# Altium schematic sheet con-right-bot.SchDoc: CS - Right Bottom
size Letter; CheckedBy: J. Brinton; CompanyName: Signal Laboratories, Inc.; DrawnBy: J. Brinton; Engineer: J. Brinton; Address1: 3479 Edison Way; Address2: Menlo Park CA 94025; Address3: +1 (877) 778-8435; Address4: siglabs.com; Revision: 3; SheetNumber: 36; SheetTotal: 47
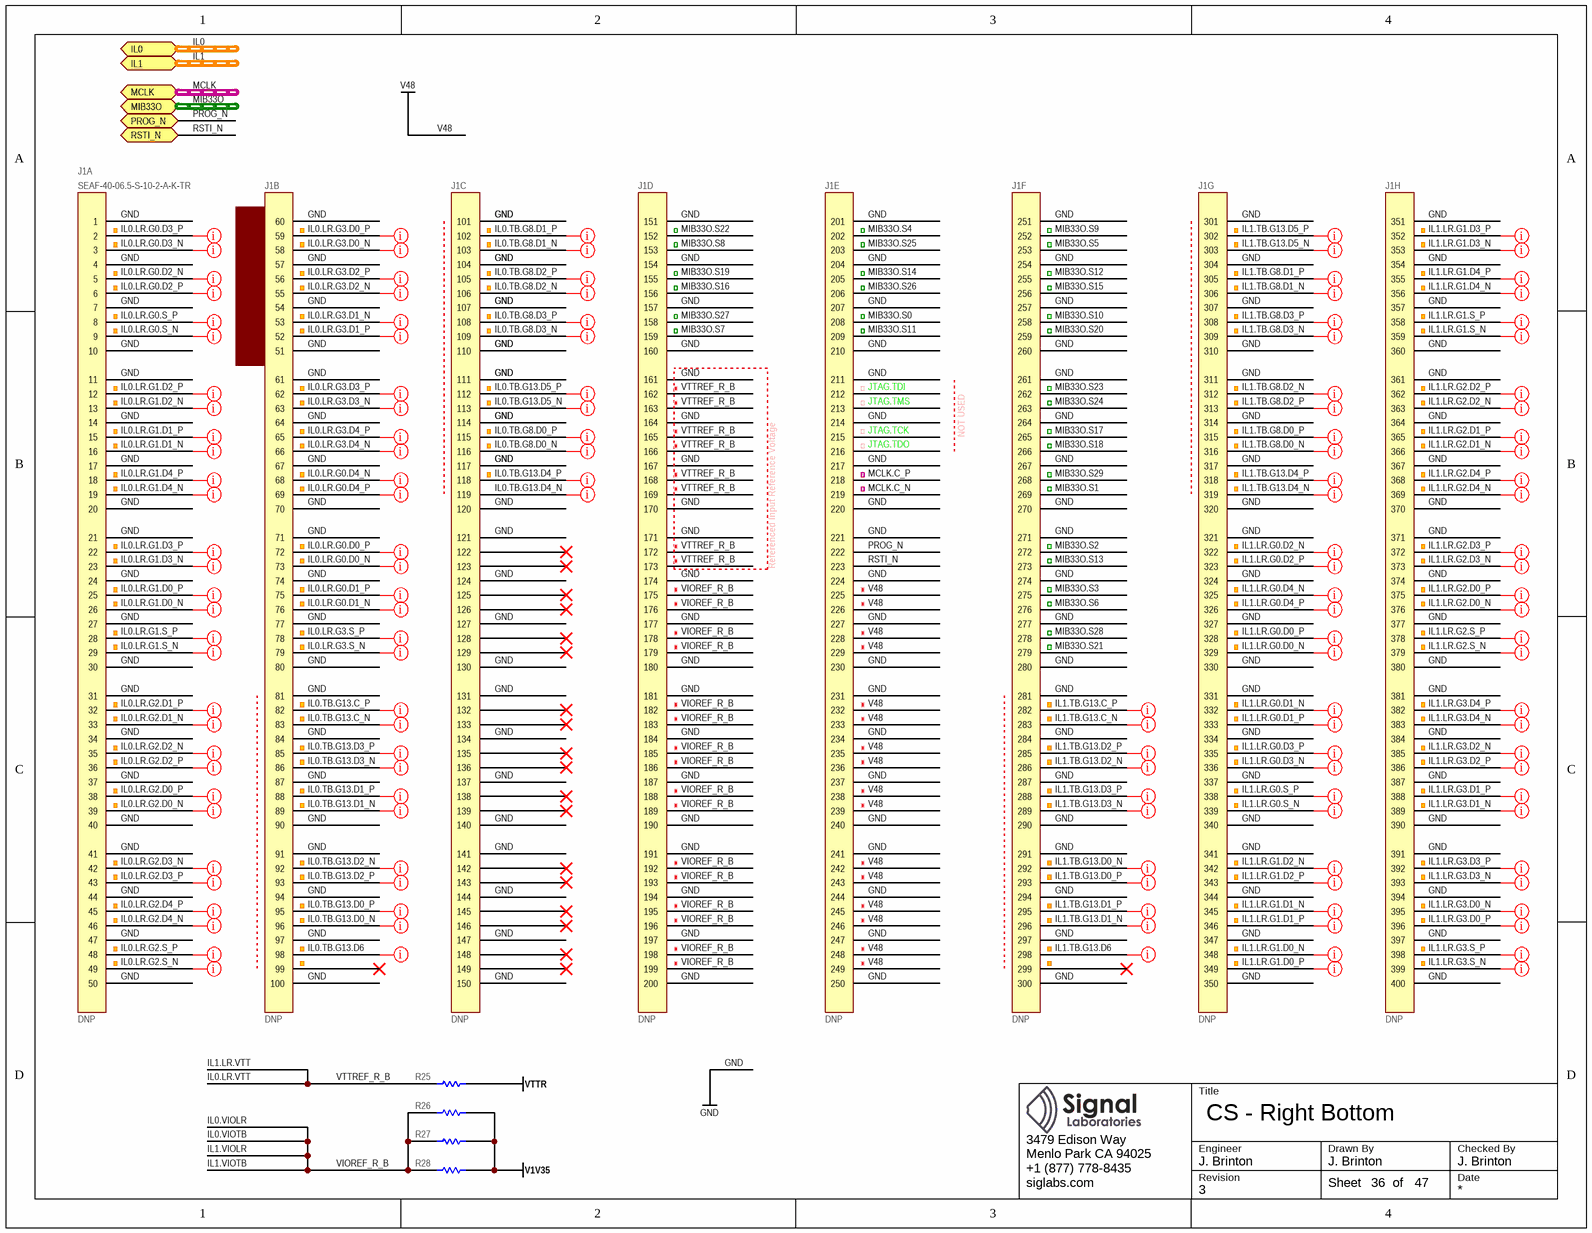
[diagram p0: con-right-bot.SchDoc]

## Parts
J1  SEAF-40-06.5-S-10-2-A-K-TR  Do Not Place: DNP  [SEAF-40-06.5-S-10-2-A-K-TR]  (parts A,B,C,D,E,F,G,H of 8)
R25  SOLDER_LINK  [SOLDERLINK0603X26N]  (value not drawn)  (no BOM)
R26  SOLDER_LINK  [SOLDERLINK0603X26N]  (value not drawn)  (no BOM)
R27  SOLDER_LINK  [SOLDERLINK0603X26N]  (value not drawn)  (no BOM)
R28  SOLDER_LINK  [SOLDERLINK0603X26N]  (value not drawn)  (no BOM)

## Ports
IL0 (harness IL), IL1 (harness IL), MCLK (harness LVPECL33), MIB33O (harness MIB), PROG_N (bidir), RSTI_N (bidir)

## Nets
GND: J1.1 J1.4 J1.7 J1.10 J1.11 J1.14 J1.17 J1.20 J1.21 J1.24 J1.27 J1.30 J1.31 J1.34 J1.37 J1.40 J1.41 J1.44 J1.47 J1.50 J1.51 J1.54 J1.57 J1.60 J1.61 J1.64 J1.67 J1.70 J1.71 J1.74 J1.77 J1.80 J1.81 J1.84 J1.87 J1.90 J1.91 J1.94 J1.97 J1.100 J1.101 J1.104 J1.107 J1.110 J1.111 J1.114 J1.117 J1.120 J1.121 J1.124 J1.127 J1.130 J1.131 J1.134 J1.137 J1.140 J1.141 J1.144 J1.147 J1.150 J1.151 J1.154 J1.157 J1.160 J1.161 J1.164 J1.167 J1.170 J1.171 J1.174 J1.177 J1.180 J1.181 J1.184 J1.187 J1.190 J1.191 J1.194 J1.197 J1.200 J1.201 J1.204 J1.207 J1.210 J1.211 J1.214 J1.217 J1.220 J1.221 J1.224 J1.227 J1.230 J1.231 J1.234 J1.237 J1.240 J1.241 J1.244 J1.247 J1.250 J1.251 J1.254 J1.257 J1.260 J1.261 J1.264 J1.267 J1.270 J1.271 J1.274 J1.277 J1.280 J1.281 J1.284 J1.287 J1.290 J1.291 J1.294 J1.297 J1.300 J1.301 J1.304 J1.307 J1.310 J1.311 J1.314 J1.317 J1.320 J1.321 J1.324 J1.327 J1.330 J1.331 J1.334 J1.337 J1.340 J1.341 J1.344 J1.347 J1.350 J1.351 J1.354 J1.357 J1.360 J1.361 J1.364 J1.367 J1.370 J1.371 J1.374 J1.377 J1.380 J1.381 J1.384 J1.387 J1.390 J1.391 J1.394 J1.397 J1.400
V1V35: R26.1 R27.1 R28.1
V48: J1.225 J1.226 J1.228 J1.229 J1.232 J1.233 J1.235 J1.236 J1.238 J1.239 J1.242 J1.243 J1.245 J1.246 J1.248 J1.249
VTTR: R25.1
IL0.LR.G0.D0_N: J1.73
IL0.LR.G0.D0_P: J1.72
IL0.LR.G0.D1_N: J1.76
IL0.LR.G0.D1_P: J1.75
IL0.LR.G0.D2_N: J1.5
IL0.LR.G0.D2_P: J1.6
IL0.LR.G0.D3_N: J1.3
IL0.LR.G0.D3_P: J1.2
IL0.LR.G0.D4_N: J1.68
IL0.LR.G0.D4_P: J1.69
IL0.LR.G0.S_N: J1.9
IL0.LR.G0.S_P: J1.8
IL0.LR.G1.D0_N: J1.26
IL0.LR.G1.D0_P: J1.25
IL0.LR.G1.D1_N: J1.16
IL0.LR.G1.D1_P: J1.15
IL0.LR.G1.D2_N: J1.13
IL0.LR.G1.D2_P: J1.12
IL0.LR.G1.D3_N: J1.23
IL0.LR.G1.D3_P: J1.22
IL0.LR.G1.D4_N: J1.19
IL0.LR.G1.D4_P: J1.18
IL0.LR.G1.S_N: J1.29
IL0.LR.G1.S_P: J1.28
IL0.LR.G2.D0_N: J1.39
IL0.LR.G2.D0_P: J1.38
IL0.LR.G2.D1_N: J1.33
IL0.LR.G2.D1_P: J1.32
IL0.LR.G2.D2_N: J1.35
IL0.LR.G2.D2_P: J1.36
IL0.LR.G2.D3_N: J1.42
IL0.LR.G2.D3_P: J1.43
IL0.LR.G2.D4_N: J1.46
IL0.LR.G2.D4_P: J1.45
IL0.LR.G2.S_N: J1.49
IL0.LR.G2.S_P: J1.48
IL0.LR.G3.D0_N: J1.58
IL0.LR.G3.D0_P: J1.59
IL0.LR.G3.D1_N: J1.53
IL0.LR.G3.D1_P: J1.52
IL0.LR.G3.D2_N: J1.55
IL0.LR.G3.D2_P: J1.56
IL0.LR.G3.D3_N: J1.63
IL0.LR.G3.D3_P: J1.62
IL0.LR.G3.D4_N: J1.66
IL0.LR.G3.D4_P: J1.65
IL0.LR.G3.S_N: J1.79
IL0.LR.G3.S_P: J1.78
IL0.LR.VTT: J1.162 J1.163 J1.165 J1.166 J1.168 J1.169 J1.172 J1.173 R25.2  [also labelled IL1.LR.VTT, VTTREF_R_B]
IL0.TB.G8.D0_N: J1.116
IL0.TB.G8.D0_P: J1.115
IL0.TB.G8.D1_N: J1.103
IL0.TB.G8.D1_P: J1.102
IL0.TB.G8.D2_N: J1.106
IL0.TB.G8.D2_P: J1.105
IL0.TB.G8.D3_N: J1.109
IL0.TB.G8.D3_P: J1.108
IL0.TB.G13.C_N: J1.83
IL0.TB.G13.C_P: J1.82
IL0.TB.G13.D0_N: J1.96
IL0.TB.G13.D0_P: J1.95
IL0.TB.G13.D1_N: J1.89
IL0.TB.G13.D1_P: J1.88
IL0.TB.G13.D2_N: J1.92
IL0.TB.G13.D2_P: J1.93
IL0.TB.G13.D3_N: J1.86
IL0.TB.G13.D3_P: J1.85
IL0.TB.G13.D4_N: J1.119
IL0.TB.G13.D4_P: J1.118
IL0.TB.G13.D5_N: J1.113
IL0.TB.G13.D5_P: J1.112
IL0.TB.G13.D6: J1.98
IL0.VIOLR: J1.175 J1.176 J1.178 J1.179 J1.182 J1.183 J1.185 J1.186 J1.188 J1.189 J1.192 J1.193 J1.195 J1.196 J1.198 J1.199 R26.2 R27.2 R28.2  [also labelled IL0.VIOTB, IL1.VIOLR, IL1.VIOTB, VIOREF_R_B]
IL1.LR.G0.D0_N: J1.329
IL1.LR.G0.D0_P: J1.328
IL1.LR.G0.D1_N: J1.332
IL1.LR.G0.D1_P: J1.333
IL1.LR.G0.D2_N: J1.322
IL1.LR.G0.D2_P: J1.323
IL1.LR.G0.D3_N: J1.336
IL1.LR.G0.D3_P: J1.335
IL1.LR.G0.D4_N: J1.325
IL1.LR.G0.D4_P: J1.326
IL1.LR.G0.S_N: J1.339
IL1.LR.G0.S_P: J1.338
IL1.LR.G1.D0_N: J1.348
IL1.LR.G1.D0_P: J1.349
IL1.LR.G1.D1_N: J1.345
IL1.LR.G1.D1_P: J1.346
IL1.LR.G1.D2_N: J1.342
IL1.LR.G1.D2_P: J1.343
IL1.LR.G1.D3_N: J1.353
IL1.LR.G1.D3_P: J1.352
IL1.LR.G1.D4_N: J1.356
IL1.LR.G1.D4_P: J1.355
IL1.LR.G1.S_N: J1.359
IL1.LR.G1.S_P: J1.358
IL1.LR.G2.D0_N: J1.376
IL1.LR.G2.D0_P: J1.375
IL1.LR.G2.D1_N: J1.366
IL1.LR.G2.D1_P: J1.365
IL1.LR.G2.D2_N: J1.363
IL1.LR.G2.D2_P: J1.362
IL1.LR.G2.D3_N: J1.373
IL1.LR.G2.D3_P: J1.372
IL1.LR.G2.D4_N: J1.369
IL1.LR.G2.D4_P: J1.368
IL1.LR.G2.S_N: J1.379
IL1.LR.G2.S_P: J1.378
IL1.LR.G3.D0_N: J1.395
IL1.LR.G3.D0_P: J1.396
IL1.LR.G3.D1_N: J1.389
IL1.LR.G3.D1_P: J1.388
IL1.LR.G3.D2_N: J1.385
IL1.LR.G3.D2_P: J1.386
IL1.LR.G3.D3_N: J1.393
IL1.LR.G3.D3_P: J1.392
IL1.LR.G3.D4_N: J1.383
IL1.LR.G3.D4_P: J1.382
IL1.LR.G3.S_N: J1.399
IL1.LR.G3.S_P: J1.398
IL1.TB.G8.D0_N: J1.316
IL1.TB.G8.D0_P: J1.315
IL1.TB.G8.D1_N: J1.306
IL1.TB.G8.D1_P: J1.305
IL1.TB.G8.D2_N: J1.312
IL1.TB.G8.D2_P: J1.313
IL1.TB.G8.D3_N: J1.309
IL1.TB.G8.D3_P: J1.308
IL1.TB.G13.C_N: J1.283
IL1.TB.G13.C_P: J1.282
IL1.TB.G13.D0_N: J1.292
IL1.TB.G13.D0_P: J1.293
IL1.TB.G13.D1_N: J1.296
IL1.TB.G13.D1_P: J1.295
IL1.TB.G13.D2_N: J1.286
IL1.TB.G13.D2_P: J1.285
IL1.TB.G13.D3_N: J1.289
IL1.TB.G13.D3_P: J1.288
IL1.TB.G13.D4_N: J1.319
IL1.TB.G13.D4_P: J1.318
IL1.TB.G13.D5_N: J1.303
IL1.TB.G13.D5_P: J1.302
IL1.TB.G13.D6: J1.298
MCLK.C_N: J1.219
MCLK.C_P: J1.218
MIB33O.S0: J1.208
MIB33O.S1: J1.269
MIB33O.S2: J1.272
MIB33O.S3: J1.275
MIB33O.S4: J1.202
MIB33O.S5: J1.253
MIB33O.S6: J1.276
MIB33O.S7: J1.159
MIB33O.S8: J1.153
MIB33O.S9: J1.252
MIB33O.S10: J1.258
MIB33O.S11: J1.209
MIB33O.S12: J1.255
MIB33O.S13: J1.273
MIB33O.S14: J1.205
MIB33O.S15: J1.256
MIB33O.S16: J1.156
MIB33O.S17: J1.265
MIB33O.S18: J1.266
MIB33O.S19: J1.155
MIB33O.S20: J1.259
MIB33O.S21: J1.279
MIB33O.S22: J1.152
MIB33O.S23: J1.262
MIB33O.S24: J1.263
MIB33O.S25: J1.203
MIB33O.S26: J1.206
MIB33O.S27: J1.158
MIB33O.S28: J1.278
MIB33O.S29: J1.268
PROG_N: J1.222 ; port PROG_N
RSTI_N: J1.223 ; port RSTI_N

Not connected (* = marked no-connect by the designer): J1 99* 122* 123* 125* 126* 128* 129* 132* 133* 135* 136* 138* 139* 142* 143* 145* 146* 148* 149* 212 213 215 216 299*

## Buses and harness runs
harness IL0 = port IL0
harness IL1 = port IL1
harness MCLK = port MCLK
harness MIB33O = port MIB33O

## Layout directives
net class z50; differential pair; net class loose: IL0.LR.G0.D0_N, IL0.LR.G0.D0_P, IL0.LR.G0.D1_N, IL0.LR.G0.D1_P, IL0.LR.G0.D2_N, IL0.LR.G0.D2_P, IL0.LR.G0.D3_N, IL0.LR.G0.D3_P, IL0.LR.G0.D4_N, IL0.LR.G0.D4_P, IL0.LR.G0.S_N, IL0.LR.G0.S_P, IL0.LR.G1.D0_N, IL0.LR.G1.D0_P, IL0.LR.G1.D1_N, IL0.LR.G1.D1_P, IL0.LR.G1.D2_N, IL0.LR.G1.D2_P, IL0.LR.G1.D3_N, IL0.LR.G1.D3_P, IL0.LR.G1.D4_N, IL0.LR.G1.D4_P, IL0.LR.G1.S_N, IL0.LR.G1.S_P, IL0.LR.G2.D0_N, IL0.LR.G2.D0_P, IL0.LR.G2.D1_N, IL0.LR.G2.D1_P, IL0.LR.G2.D2_N, IL0.LR.G2.D2_P, IL0.LR.G2.D3_N, IL0.LR.G2.D3_P, IL0.LR.G2.D4_N, IL0.LR.G2.D4_P, IL0.LR.G2.S_N, IL0.LR.G2.S_P, IL0.LR.G3.D0_N, IL0.LR.G3.D0_P, IL0.LR.G3.D1_N, IL0.LR.G3.D1_P, IL0.LR.G3.D2_N, IL0.LR.G3.D2_P, IL0.LR.G3.D3_N, IL0.LR.G3.D3_P, IL0.LR.G3.D4_N, IL0.LR.G3.D4_P, IL0.LR.G3.S_N, IL0.LR.G3.S_P, IL0.TB.G8.D0_N, IL0.TB.G8.D0_P, IL0.TB.G8.D1_N, IL0.TB.G8.D1_P, IL0.TB.G8.D2_N, IL0.TB.G8.D2_P, IL0.TB.G8.D3_N, IL0.TB.G8.D3_P, IL0.TB.G13.C_N, IL0.TB.G13.C_P, IL0.TB.G13.D0_N, IL0.TB.G13.D0_P, IL0.TB.G13.D1_N, IL0.TB.G13.D1_P, IL0.TB.G13.D2_N, IL0.TB.G13.D2_P, IL0.TB.G13.D3_N, IL0.TB.G13.D3_P, IL0.TB.G13.D4_N, IL0.TB.G13.D4_P, IL0.TB.G13.D5_N, IL0.TB.G13.D5_P, IL1.LR.G0.D0_N, IL1.LR.G0.D0_P, IL1.LR.G0.D1_N, IL1.LR.G0.D1_P, IL1.LR.G0.D2_N, IL1.LR.G0.D2_P, IL1.LR.G0.D3_N, IL1.LR.G0.D3_P, IL1.LR.G0.D4_N, IL1.LR.G0.D4_P, IL1.LR.G0.S_N, IL1.LR.G0.S_P, IL1.LR.G1.D0_N, IL1.LR.G1.D0_P, IL1.LR.G1.D1_N, IL1.LR.G1.D1_P, IL1.LR.G1.D2_N, IL1.LR.G1.D2_P, IL1.LR.G1.D3_N, IL1.LR.G1.D3_P, IL1.LR.G1.D4_N, IL1.LR.G1.D4_P, IL1.LR.G1.S_N, IL1.LR.G1.S_P, IL1.LR.G2.D0_N, IL1.LR.G2.D0_P, IL1.LR.G2.D1_N, IL1.LR.G2.D1_P, IL1.LR.G2.D2_N, IL1.LR.G2.D2_P, IL1.LR.G2.D3_N, IL1.LR.G2.D3_P, IL1.LR.G2.D4_N, IL1.LR.G2.D4_P, IL1.LR.G2.S_N, IL1.LR.G2.S_P, IL1.LR.G3.D0_N, IL1.LR.G3.D0_P, IL1.LR.G3.D1_N, IL1.LR.G3.D1_P, IL1.LR.G3.D2_N, IL1.LR.G3.D2_P, IL1.LR.G3.D3_N, IL1.LR.G3.D3_P, IL1.LR.G3.D4_N, IL1.LR.G3.D4_P, IL1.LR.G3.S_N, IL1.LR.G3.S_P, IL1.TB.G8.D0_N, IL1.TB.G8.D0_P, IL1.TB.G8.D1_N, IL1.TB.G8.D1_P, IL1.TB.G8.D2_N, IL1.TB.G8.D2_P, IL1.TB.G8.D3_N, IL1.TB.G8.D3_P, IL1.TB.G13.C_N, IL1.TB.G13.C_P, IL1.TB.G13.D0_N, IL1.TB.G13.D0_P, IL1.TB.G13.D1_N, IL1.TB.G13.D1_P, IL1.TB.G13.D2_N, IL1.TB.G13.D2_P, IL1.TB.G13.D3_N, IL1.TB.G13.D3_P, IL1.TB.G13.D4_N, IL1.TB.G13.D4_P, IL1.TB.G13.D5_N, IL1.TB.G13.D5_P
net class z50: IL0.TB.G13.D6, IL1.TB.G13.D6

## Notes on the sheet
- (near J1) JTAG.TDI
- (near J1) JTAG.TCK
- (near J1) JTAG.TDO
- (near J1) JTAG.TMS
- NOT USED
- Referenced Input Reference Voltage
- Title
- Engineer
- Revision
- Drawn By
- Checked By
- Date
- Sheet
- of

## Library data of the parts
J1 = SEAF-40-06.5-S-10-2-A-K-TR: Terminal Array Assembly, Surface Mount, 0.050" Pitch, 400 Pins; Manufacturer: Samtec; Manufacturer P/N: SEAF-40-06.5-S-10-2-A-K-TR
R25-R28 = RES: Solder Link; Manufacturer P/N: *; Manufacturer: *